# Altium schematic sheet VIPer22A.SchDoc
size A4
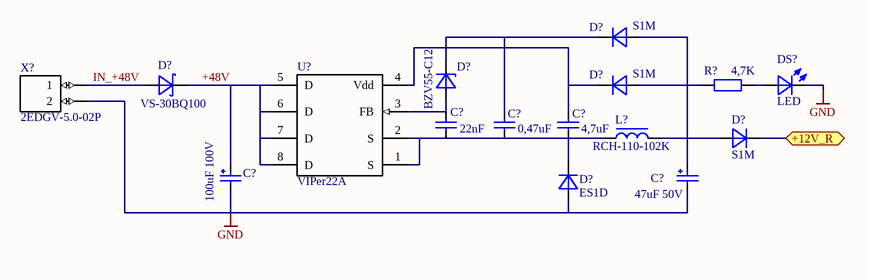
[diagram p0: VIPer22A.SchDoc]

## Parts
(Parts that share a designator on the sheet are numbered #1, #2 ... from top to bottom, then left to right.)
C?#1  22nF  [C_0805]
C?#2  0,47uF  [C_1206]
C?#3  4,7uF  [C_1206]
C?#4  100uF 100V  [12.5x20]
C?#5  47uF 50V  [6.3x11]
D?#1  S1M  [SMA]
D?#2  BZV55-C12  [SOD80C]
D?#3  VS-30BQ100  [SMC]
D?#4  S1M  [SMA]
D?#5  S1M  [SMA]
D?#6  ES1D  [SMA]
DS?  LED  [LED_SMD_1206]
L?  RCH-110-102K  [RCH-110]
R?  value 4,7K  [R_1206]  (hidden comment: Resistor 1206)
U?  VIPer22A  [DIP-8]
X?  2EDGV-5.0-02P  [2EDGV-5.0-02P]

## Ports
+12V_R

## Nets
GND: C?#4.2 C?#5.2 D?#6.1(A) DS?.2(C) X?.2
+12V_R: D?#5.2(C) ; port +12V_R
+48V: C?#4.1 D?#3.2(C) U?.5(D) U?.6(D) U?.7(D) U?.8(D)
IN_+48V: D?#3.1(A) X?.1
NetC?#1_1: C?#1.1 D?#2.1(A) U?.3(FB)
NetC?#1_2: C?#1.2 C?#2.2 C?#3.2 D?#6.2(C) L?.2 U?.1(S) U?.2(S)
NetC?#2_1: C?#2.1 D?#1.2(C) D?#2.2(C)
NetC?#3_1: C?#3.1 D?#4.2(C) U?.4(Vdd)
NetC?#5_1: C?#5.1 D?#1.1(A) D?#4.1(A) D?#5.1(A) L?.1 R?.2
NetDS?_1: DS?.1(A) R?.1

## Library data of the parts
C?#1-C?#3 = Cap_Semi: Capacitor semi
C?#4 C?#5 = Capacitor Polar
D?#1 D?#4 D?#5 = S1M: Diode
D?#2 = BZV55-C3V3: Zener Diode
D?#3 = VS-30BQ100: Diode Schottky
D?#6 = ES1D: Diode
DS? = LED: LED_SMD
L? = Induction
U? = VIPer22A: Low power OFF-line SMPS primary switcher
X? = 2EDGV-5.0-02P: Connector 5mm